# Altium schematic sheet STlink.SchDoc
size A4; SheetNumber: 8; SheetTotal: 8
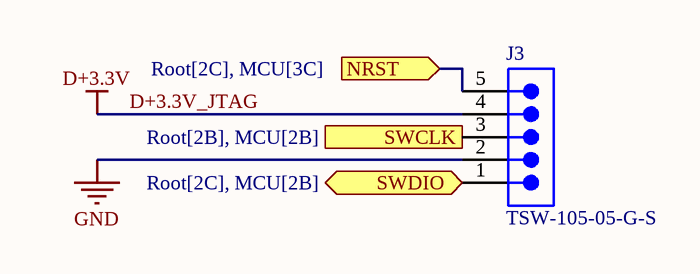
[diagram p0: STlink.SchDoc]

## Parts
J3  TSW-105-05-G-S  [SMTC-TSW-105-05-X-S]

## Ports
NRST (in, see Root[2C], MCU[3C]), SWCLK (out, see Root[2B], MCU[2B]), SWDIO (bidir, see Root[2C], MCU[2B])

## Nets
D+3.3V_JTAG: J3.4  [also labelled D+3.3V]
GND: J3.2
NRST: J3.5 ; port NRST
SWCLK: J3.3 ; port SWCLK
SWDIO: J3.1 ; port SWDIO

## Library data of the parts
J3 = CMP-1024-00363-1: 0.025" SQ Post Header, Through-hole, Vertical, -55 to 125 degC, 2.54 mm Pitch, 5-Pin, Male, RoHS; Manufacturer: Samtec; Pitch: 2.54 mm; ComponentLink3URL: http://www.samtec.com/documents/webfiles/cpdf/TSW-XXX-XX-XXX-X-XX-XXX-MKT.pdf; RoHS: True; PackageReference: TSW-105-05-X-S; Orientation: Vertical; ComponentLink2Description: Datasheet; Mounting Technology: Through-hole; PackageVersion: DM, 8/1988; PartNumber: TSW-105-05-G-S; ComponentLink1Description: Manufacturer URL; PackageDescription: .025[0.64] SQ. Post Terminal Strip Assembly; ComponentLink1URL: http://www.samtec.com; DatasheetVersion: F-214; Temperature Range: -55 to 125 degC; ComponentLink3Description: Package Specification; ComponentLink2URL: http://www.samtec.com/documents/webfiles/pdf/TSW_TH.PDF